# EAGLE design samDEV_09-rev1.1 (EAGLE 7.2.0)
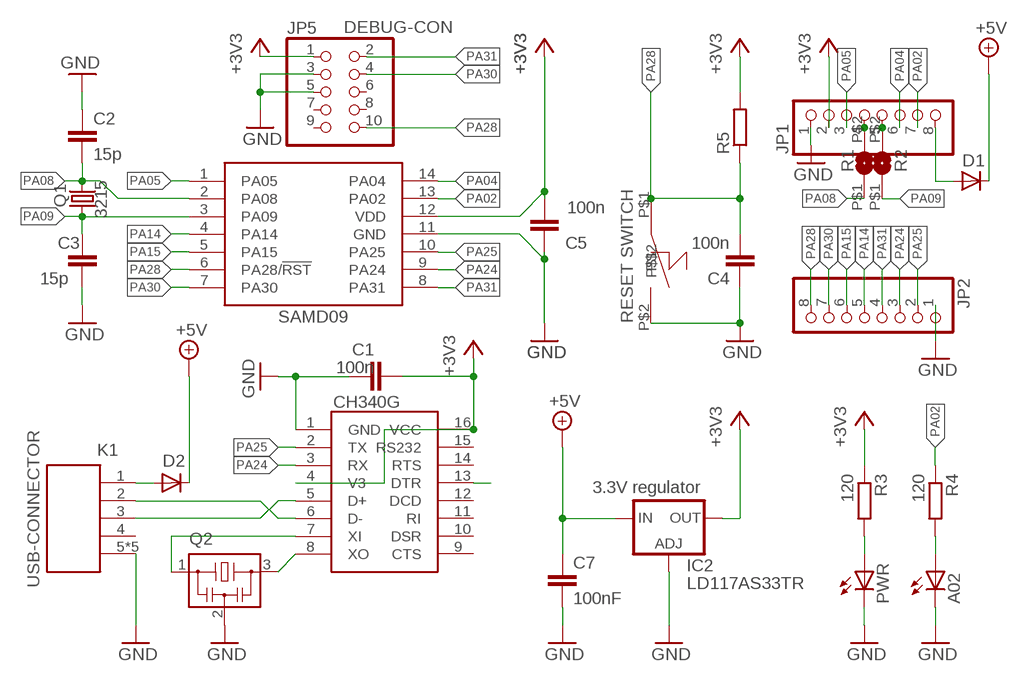
[diagram p0: schematic, sheet 1]

## Parts
A02  LEDCHIPLED_0603  [CHIPLED_0603]
C1  100n  C-EUC0603  [C0603]
C2  15p  C-EUC0603  [C0603]
C3  15p  C-EUC0603  [C0603]
C4  100n  C-EUC0603  [C0603]
C5  100n  C-EUC0603  [C0603]
C7  100nF  C-EUC0603  [C0603]
D1  MBR0520LT  [SOD123]
D2  MBR0520LT  [SOD123]
IC1  CH340G  [SOIC16]
IC2  LD117AS33TR  [SOT223]
JP1  PINHD-1X8OCTA  [1X08_OCTA]
JP2  PINHD-1X8OCTA  [1X08_OCTA]
JP5  PINHD-2X51272  [2X05_1,27B]
K1  629105136821  [629105136821]
PWR  LEDCHIPLED_0603  [CHIPLED_0603]
Q1  3215  [3215]
Q2  CSTCRCSTCE_SMALL_FOOT  [CSTCESMALL]
R1  SJAL  [SMD_AL1]
R2  SJAL  [SMD_AL1]
R3  120  R-EU_R0603  [R0603]
R4  120  R-EU_R0603  [R0603]
R5  R-EU_R0603  [R0603]
S2  SMD_SWITCH  [SMDSWITCH]
U$1  SAMD09SOIC14  [SO14]

## Nets
+3V3: C1.2 C5.2 IC1.4(V3) IC1.16(VCC) IC2.2(OUT) IC2.4(OUT) JP1.2 JP5.1 R3.1 R5.2 U$1.12(VDD)
+5V: C7.1 D1.C D2.C IC2.3(IN)
GND: A02.C C1.1 C2.1 C3.2 C4.1 C5.1 C7.2 IC1.1(GND) IC2.1(ADJ) JP1.1 JP2.1 JP5.3 JP5.5 K1.5 K1.Z1 K1.Z2 K1.Z3 K1.Z4 PWR.C Q2.2 S2.P$2 U$1.11(GND)
N$1: D1.A JP1.8
N$2: D2.A K1.1
N$3: PWR.A R3.2
N$4: JP1.4 R1.P$2
N$5: JP1.5 R2.P$2
N$7: A02.A R4.2
N$9: IC1.6(D-) K1.2
N$10: IC1.5(D+) K1.3
N$11: IC1.8(XO) Q2.3
N$12: IC1.7(XI) Q2.1
PA02: JP1.7 R4.1 U$1.13(PA02)
PA04: JP1.6 U$1.14(PA04)
PA05: JP1.3 U$1.1(PA05)
PA08: C2.2 Q1.2 R1.P$1 U$1.2(PA08)
PA09: C3.1 Q1.1 R2.P$1 U$1.3(PA09)
PA14: JP2.5 U$1.4(PA14)
PA15: IC1.13(DTR) JP2.6 U$1.5(PA15)
PA24: IC1.3(RX) JP2.3 U$1.9(PA24)
PA25: IC1.2(TX) JP2.2 U$1.10(PA25)
PA28: C4.2 JP2.8 JP5.10 R5.1 S2.P$1 U$1.6(PA28/!RST)
PA30: JP2.7 JP5.4 U$1.7(PA30)
PA31: JP2.4 JP5.2 U$1.8(PA31)
Unconnected: IC1.9(CTS) IC1.10(DSR) IC1.11(RI) IC1.12(DCD) IC1.14(RTS) IC1.15(RS232) JP5.6 JP5.7 JP5.8 JP5.9 K1.4

## Notes on the sheet
- DEBUG-CON
- SAMD09 | RESET SWITCH
- 3.3V regulator
- USB-CONNECTOR

## Library data of the parts
A02 PWR = led:LED: LED OSRAM: - CHIPLED LG R971, LG N971, LY N971, LG Q971, LY Q971, LO R971, LY R971 LH N974, LH R974 LS Q976, LO Q976, LY Q976 LO Q996 - Hyper CHIPLED LW Q18S LB Q993, LB Q99A, LB R99A - SideLED LS A670, LO A670, LY A670, LG A670, LP A670 LB A673, LV A673, LT A673, LW A673 LH A674 LY A675 LS A676, LA A676, LO A676, LY A676, LW A676 LS A679, LY A679, LG A679 - Hyper Micro SIDELED® LS Y876, LA Y876, LO Y876, LY Y876 LT Y87S - SmartLED LW L88C, LW L88S LB L89C, LB L89S, LG L890 LS L89K, LO L89K, LY L89K LS L896, LA L896, LO L896, LY L896 - TOPLED LS T670, LO T670, LY T670, LG T670, LP T670 LSG T670, LSP T670, LSY T670, LOP T670, LYG T670 LG T671, LOG T671, LSG T671 LB T673, LV T673, LT T673, LW T673 LH T674 LS T676, LA T676, LO T676, LY T676, LB T676, LH T676, LSB T676, LW T676 LB T67C, LV T67C, LT T67C, LS T67K, LO T67K, LY T67K, LW E67C LS E67B, LA E67B, LO E67B, LY E67B, LB E67C, LV E67C, LT E67C LW T67C LS T679, LY T679, LG T679 LS T770, LO T770, LY T770, LG T770, LP T770 LB T773, LV T773, LT T773, LW T773 LH T774 LS E675, LA E675, LY E675, LS T675 LS T776, LA T776, LO T776, LY T776, LB T776 LHGB T686 LT T68C, LB T68C - Hyper Mini TOPLED® LB M676 - Mini TOPLED Santana® LG M470 LS M47K, LO M47K, LY M47K Source: http://www.osram.convergy.de LUXEON: - LUMILED® LXK2-PW12-R00, LXK2-PW12-S00, LXK2-PW14-U00, LXK2-PW14-V00 LXK2-PM12-R00, LXK2-PM12-S00, LXK2-PM14-U00 LXK2-PE12-Q00, LXK2-PE12-R00, LXK2-PE12-S00, LXK2-PE14-T00, LXK2-PE14-U00 LXK2-PB12-K00, LXK2-PB12-L00, LXK2-PB12-M00, LXK2-PB14-N00, LXK2-PB14-P00, LXK2-PB14-Q00 LXK2-PR12-L00, LXK2-PR12-M00, LXK2-PR14-Q00, LXK2-PR14-R00 LXK2-PD12-Q00, LXK2-PD12-R00, LXK2-PD12-S00 LXK2-PH12-R00, LXK2-PH12-S00 LXK2-PL12-P00, LXK2-PL12-Q00, LXK2-PL12-R00 Source: www.luxeon.com KINGBRIGHT: KA-3528ASYC Source: www.kingbright.com
C1-C5 C7 = rcl:C-EU: CAPACITOR, European symbol
D1 D2 = diode:MBR0520LT: SCHOTTKY BARRIER RECTIFIER Source: http://onsemi.com .. MBR0520LT1-D.pdf
IC1 = usb-serial:CH340G
IC2 = v-reg:LD117A?*: Low drop fixed and adjustable positive voltage regulators 1 A Source: http://www.st.com/stonline/products/literature/ds/7194/ld1117axx.pdf
JP1 JP2 = pinhead:PINHD-1X8: PIN HEADER
JP5 = pinhead:PINHD-2X5: PIN HEADER
K1 = USBSteckverbinderWR-COM:629105136821: WR-COM SMT Horizontal 5 Contacts Micro USB Type B,5 pins=>Code : Con_I-O_COM_MicroUSB_629105136821 <http://katalog.we-online.de/media/images/eican/Con_I-O_COM_MicroUSB_629105136821_pf2.jpg> Details see: http://katalog.we-online.de/en/em/629_105_136_821 Created 2014-07-09, Karrer Zheng 2014 (C) Würth Elektronik
Q1 = crystal:3215
Q2 = murata-filter:CSTCR: Resonator Source: murata.co.jp
R1 R2 = jumper:SJ: SMD solder JUMPER
R3-R5 = rcl:R-EU_: RESISTOR, European symbol
S2 = _miniRoboter:SMD_SWITCH
U$1 = atmel:SAMD09

## Board
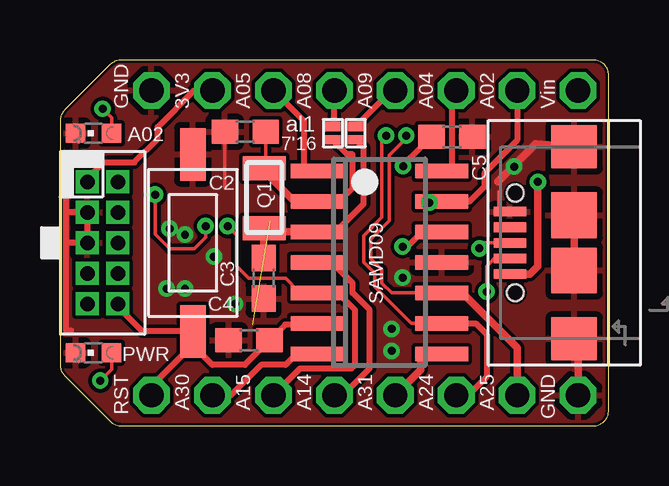
[diagram p1: board, top side]
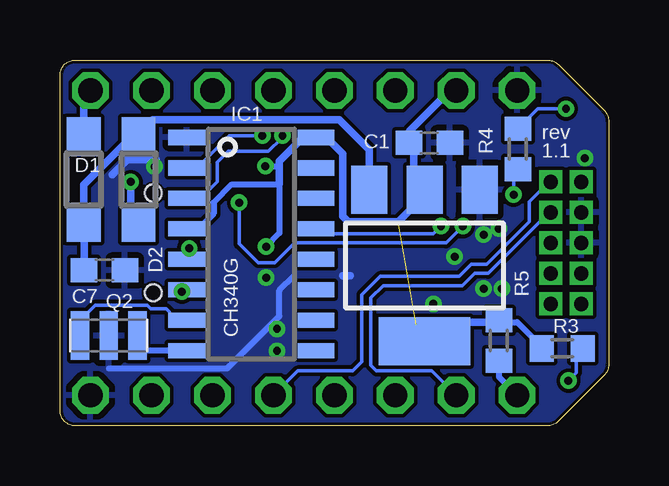
[diagram p2: board, bottom side, seen from below]

Size 22.86 x 15.24 mm. Coordinates in mm from the lower left corner, seen from the top.
Outline: 2.1,15.05 0.19,13.14 arc45 0,12.69 0,2.55 arc45 0.19,2.1 2.1,0.19 arc45 2.55,0 22.23,0 arc90 22.86,0.64 22.86,14.61 arc90 22.23,15.24 2.55,15.24 arc45 2.1,15.05
Copper layers (1*16): Top 0.0356mm / dielectric 1.5011mm / Bottom 0.0356mm
Design rules "oshpark-2layer *": minimum track width 6mil, minimum drill 13mil, track to track 6mil, track to pad 6mil, pad to pad 6mil, via to via 6mil, smd to smd 6mil, copper to edge 5mil, drill to drill 6mil, minimum pad ring 7mil, minimum via ring 7mil, stop-mask expansion 1mil, vias tented up to drill 13mil, thermal gap 10mil

### Footprints (pad centres in the part's own frame; a part is rotated, then mirrored left to right if it is on the bottom)
CHIPLED_0603 = smd 0.8 x 0.8: A 0,-0.75; C 0,0.75
C0603 = smd 1.1 x 1: 1 -0.85,0; 2 0.85,0
SOD123 = smd 1.4 x 1.4: A 1.9,0; C -1.9,0
SOIC16 = smd 0.635 x 1.524: 1 -4.445,-2.695; 2 -3.175,-2.695; 3 -1.905,-2.695; 4 -0.635,-2.695; 5 0.635,-2.695; 6 1.905,-2.695; 7 3.175,-2.695; 8 4.445,-2.695; 9 4.445,2.695; 10 3.175,2.695; 11 1.905,2.695; 12 0.635,2.695; 13 -0.635,2.695; 14 -1.905,2.695; 15 -3.175,2.695; 16 -4.445,2.695
SOT223 = smd 1.5 x 2: 1 -2.3,-3.15; 2 0,-3.15; 3 2.3,-3.15 | smd 3.8 x 2: 4 0,3.15
1X08_OCTA = drill 1.016 octagon: 1 -8.89,0; 2 -6.35,0; 3 -3.81,0; 4 -1.27,0; 5 1.27,0; 6 3.81,0; 7 6.35,0; 8 8.89,0
2X05_1,27B = drill 0.6 square: 1 -2.54,-0.635; 2 -2.54,0.635; 3 -1.27,-0.635; 4 -1.27,0.635; 5 0,-0.635; 6 0,0.635; 7 1.27,-0.635; 8 1.27,0.635; 9 2.54,-0.635; 10 2.54,0.635
629105136821 = smd 0.4 x 1.35: 1 -1.3,0; 2 -0.65,0; 3 0,0; 4 0.65,0; 5 1.3,0 | smd 1.8 x 1.9: Z1 -4,-2.675; Z4 4,-2.675 | smd 1.9 x 1.9: Z2 -1.15,-2.675; Z3 1.15,-2.675 | hole 0.7: -2.075,-0.225; 2.075,-0.225
3215 = smd 1 x 1.8: 1 -1.25,0; 2 1.25,0
CSTCESMALL = smd 0.762 x 2.032: 1 -1.2,0; 2 0,0; 3 1.2,0
SMD_AL1 = smd 0.381 x 0.635: P$1 -0.279,0; P$2 0.279,0
R0603 = smd 1 x 1.1: 1 -0.85,0; 2 0.85,0
SMDSWITCH = smd 2.184 x 1.067: P$1 -3.685,0; P$2 3.685,0
SO14 = smd 0.6 x 2.2: 1 -3.81,-2.6; 2 -2.54,-2.6; 3 -1.27,-2.6; 4 0,-2.6; 5 1.27,-2.6; 6 2.54,-2.6; 7 3.81,-2.6; 8 3.81,2.6; 9 2.54,2.6; 10 1.27,2.6; 11 0,2.6; 12 -1.27,2.6; 13 -2.54,2.6; 14 -3.81,2.6

### Placement (x,y rotation side)
A02  1.4,12.19 90 top
C1  7.47,11.79 180 bottom
C2  7.72,12.24 0 top
C3  8.48,6.15 270 top
C4  7.87,3.56 0 top
C5  16.33,12.04 180 top
C7  21.01,6.48 0 bottom
D1  21.87,10.26 90 bottom
D2  19.58,10.26 270 bottom
IC1  14.88,7.57 270 bottom
IC2  7.67,6.68 180 bottom
JP1  12.7,13.97 0 top
JP2  12.7,1.27 180 top
JP5  1.78,7.62 270 top
K1  18.75,7.62 90 top
PWR  1.4,3.05 90 top
Q1  8.51,9.47 90 top
Q2  20.83,3.76 0 bottom
R1  11.37,12.19 90 top
R2  12.32,12.19 90 top
R3  1.93,3.23 0 bottom
R4  3.78,11.53 90 bottom
R5  4.57,3.56 90 bottom
S2  5.54,7.62 90 top
U$1  13.31,6.81 270 top

### Tracks (layer width: path | path; a pad name or v marks a point on that pad's centre or on a via)
+3V3  (via drill 0.33)  (1 unrouted)
  Top 0.254: JP5.1 1.14,10.29 1.83,10.97 3.1,10.97 4.06,11.94 4.06,12.45 5.59,13.97 JP1.2 | U$1.12 15.09,8.08 14.48,7.47 v14.28,7.47 | C5.2 14.33,10.91 v14.3,10.82
  Bottom 0.254: 8.03,4.22 7.85,4.22 IC2.4 7.64,4.06 7.11,4.06 | 2.97,2.97 R3.1 2.93,3.44 3.81,4.32 4.32,4.32 4.41,4.41 R5.2 | 17.25,8.2 IC1.4 17.4,8.38 16.92,8.38 16.46,8.84 16.46,9.3 15.7,10.06 13.72,10.06 13.72,8.03 v14.28,7.47 | v14.3,10.82 13.72,10.82
  Bottom 0.305: 6.35,13.75 JP1.2 6.6,13.97 8.28,12.29 C1.2 8.13,12.1 8.13,10.79 IC2.2 | 13.72,10.06 13.72,10.82 13.72,11.02 12.72,12.01 IC1.16 11.76,12.01 11.07,11.33 11.07,8.72 10.86,8.51 8.76,8.51 7.67,9.6 IC2.2 | 7.67,9.88 IC2.2 | 7.67,10.11 IC2.2 | R5.2 4.66,4.32 6.88,4.32 IC2.4
+5V
  Bottom 0.305: IC2.3 9.97,11.49 11.23,12.75 18.99,12.75 D2.C 19.74,12.16 21.87,10.03 D1.C 21.86,8.35 C7.1
GND  (via drill 0.33)
  Top 0.152: 20.81,4.05 K1.Z1 | 21.18,11.99 K1.Z4 | 8.48,5.27 8.48,4.93 | C2.1 6.87,9.92 | 18.29,9.75 18.29,8.84
  Top 0.254: C3.2 8.48,5.27 8.48,5.18 | 0.25,8.89 JP5.3 JP5.5 0.25,7.62 | 0.25,8.89 0.25,11.18 | 0.25,7.62 0.25,3.96 0.46,3.96 | 0.25,7.62 0.25,8.89
  Top 0.305: 22.2,5.89 22.05,5.89 21.42,6.52 K1.Z2 K1.Z3 | 18.24,10.16 19.82,11.75 K1.Z4 | JP2.1 21.59,3.58 K1.Z1 | S2.P$2 5.54,11.73
  Bottom 0.254: 20.83,2.39 15.9,2.39 13.72,4.57 13.72,5.64 13.11,6.25
  Bottom 0.305: IC1.1 18.06,11.86 | 18.85,11.07 20.07,11.07 20.68,10.46 | 5.8,10.31 IC2.1 | IC2.1 5.41,9.88 | JP2.1 21.59,1.63 | JP1.1 4.43,13.97 | 11.07,6.25 10.77,6.25 | IC2.1 5.37,9.92
  other vias: 6.41,7.05 5.21,7.96 14.27,6.17 18.92,10.79 4.45,5.71 5.21,5.71 13.82,4.04 13.82,3.12 0.99,11.15 7.3,5.08 4.57,8.22
  pour Bottom: -0.25,15.24 0,0 23.11,-0.25 22.86,15.24
  pour Top: 22.86,15.24 -0.25,15.24 0,0 23.11,-0.25
N$1
  Bottom 0.305: JP1.8 21.87,13.69 D1.A
N$2  (via drill 0.33)
  Top 0.305: v19.91,10.16 19.91,6.66 19.58,6.32 K1.1
  Bottom 0.305: v19.91,10.16 19.91,8.69 D2.A
N$3  (via drill 0.33)
  Top 0.152: 2,3 PWR.A 2.15,2.35 v1.68,1.88
  Bottom 0.152: 1.35,2.97 1.35,2.21 v1.68,1.88
  Bottom 0.254: R3.2 1.35,2.97 1.35,2.92
N$4
  Top 0.254: 11.38,13.92 JP1.4 11.43,12.54 R1.P$2
N$5
  Top 0.254: R2.P$2 13.82,13.97 JP1.5
N$7  (via drill 0.33)
  Top 0.152: 2.44,12.5 2.33,12.38 2.33,12.29 A02.A 2.15,12.84 v1.78,13.21
  Bottom 0.152: 4.03,12.29 R4.2 2.96,13.21 v1.78,13.21
N$9  (via drill 0.33)
  Top 0.152: K1.2 18.22,7.1 17.78,6.66 v17.78,5.59
  Bottom 0.152: v17.78,5.59 17.86,5.66 IC1.6
N$10  (via drill 0.33)
  Top 0.152: K1.3 17.7,7.62 v17.48,7.39
  Bottom 0.152: v17.48,7.39 17.55,7.26 IC1.5
N$11
  Bottom 0.152: 19.58,2.97 19.61,3 19.61,3.2 19.61,3.59 Q2.3
  Bottom 0.254: IC1.8 19.53,3.12 19.61,3.2
N$12
  Bottom 0.152: Q2.1 22.05,3.63 21.89,4.37 21.89,4.52 21.39,5.03 19.23,5.03 19.07,4.88 18.44,4.88 18.14,4.57 17.76,4.57 IC1.7
PA02  (via drill 0.33)
  Top 0.152: v3.96,9.63 3.96,7.98 4.57,7.37 5.59,7.37 6.07,7.85 v6.07,8.32
  Top 0.254: JP1.7 19.05,11.89 17.68,10.52 17.68,9.96 17.07,9.35 16.05,9.35 | 16.05,9.35 U$1.13 | 16.05,9.35 16,9.4 v15.39,9.3
  Bottom 0.152: 3.96,10.5 v3.96,9.63 | v6.07,8.32 6.77,7.62 13.08,7.62 13.91,6.79 14.61,6.79 15.39,7.58 v15.39,9.3
  Bottom 0.254: 3.66,10.55 R4.1 3.96,10.5
PA04
  Top 0.254: 16.51,10.67 16.46,10.62 | 16.46,10.62 U$1.14 | JP1.6 16.33,13.77 16.33,10.77 16.46,10.62
PA05
  Top 0.254: JP1.3 10.16,12.7 10.16,10.67 10.21,10.62 U$1.1
PA08
  Top 0.152: 8.69,10.62 Q1.2 8.57,10.66 C2.2
  Top 0.254: U$1.2 10.76,9.4 11.68,9.4 12.19,9.91 12.19,11.3 11.96,11.3 11.37,11.9 R1.P$1
  Top 0.305: Q1.2 8.63,10.47 9.75,9.35 U$1.2
PA09
  Top 0.152: 8.48,8.33 Q1.1
  Top 0.254: U$1.3 10.76,8.13 11.53,8.13 12.65,9.25 12.65,11.58 R2.P$1
  Top 0.305: U$1.3 8.49,8.08 Q1.1 | 8.48,8.33 C3.1
PA14
  Top 0.254: JP2.5 11.79,1.27 12.9,2.39 12.9,4.83 12.19,5.54 12.19,5.94 11.53,6.6 11.53,6.81 U$1.4
PA15  (via drill 0.33)
  Top 0.152: 11.58,5.54 9.96,5.54 9.96,5.59 9.4,6.15 7.87,6.15 7.37,6.66 7.37,7.94 v6.99,8.32
  Top 0.254: JP2.6 10.01,2.39 12.14,2.39 12.29,2.54 12.29,4.83 11.58,5.54 U$1.5
  Bottom 0.152: IC1.13 11.99,8 7.3,8 v6.99,8.32
  Bottom 0.254: 12.01,8.38 IC1.13
PA24  (via drill 0.33)
  Top 0.152: 16.05,4.27 U$1.9 14.63,4.27 13.11,5.79 13.11,6.35 12.65,6.81 12.65,7.92 13.41,8.69 13.41,11.89 v13.59,12.09
  Top 0.254: 16.76,1.27 JP2.3 17.02,1.27 17.78,2.03 17.78,3.81 17.32,4.27 U$1.9
  Bottom 0.152: 16.99,9.47 16.31,10.16 16.31,10.97 15.85,11.43 14.17,11.43 13.61,11.99 v13.59,12.09
  Bottom 0.254: 16.99,9.47 IC1.3
PA25  (via drill 0.33)
  Top 0.152: 16.76,5.54 13.82,5.54 13.41,5.94 13.41,6.5 12.95,6.96 12.95,7.77 13.72,8.53 13.72,11.28 14.43,11.99 v14.43,12.09
  Top 0.305: U$1.10 16.76,5.54 19.05,3.25 JP2.2
  Bottom 0.152: v14.43,12.09 15.8,12.09 17.14,10.74
  Bottom 0.254: 17.14,10.74 IC1.2
PA28
  Top 0.254: U$1.6 10.66,4.22 9.38,4.22 C4.2 7.71,2.54 6.35,2.54 5.54,3.35 S2.P$1 | JP5.10 2.41,4.95 3.43,3.94 S2.P$1 | S2.P$1 5.54,3 5.16,3 3.81,1.65 JP2.8
  Bottom 0.254: R5.1 4.57,2.03 JP2.8
PA30
  Top 0.254: U$1.7 9.86,3 9.4,2.54 8.38,2.54 7.11,1.27 JP2.7
  Bottom 0.152: JP2.7 7.37,2.29 9.68,2.29 9.91,2.52 9.91,5.33 9.4,5.84 6.1,5.84 5.59,6.35 5.02,6.35 2.48,8.89 JP5.4
PA31
  Top 0.305: U$1.8 arc60 15.04,2.85 15.04,2.34 JP2.4
  Bottom 0.152: JP2.4 12.95,2.29 10.67,2.29 10.29,2.67 10.29,5.46 9.53,6.22 6.22,6.22 5.71,6.73 5.08,6.73 3.3,8.51 3.3,9.34 2.48,10.16 JP5.2

### Text on the board
tNames: GND | 3V3 | A05 | al1 | A08 | A09 | A04 | A02 | Vin | 7'16 | SAMD09 | RST | A30 | A15 | A14 | A31 | A24 | A25 | GND
bNames: IC1 | rev | 1.1